# Altium schematic sheet 24Vto5V.SchDoc
size 420 x 297 mm; SheetNumber: 3; SheetTotal: 5
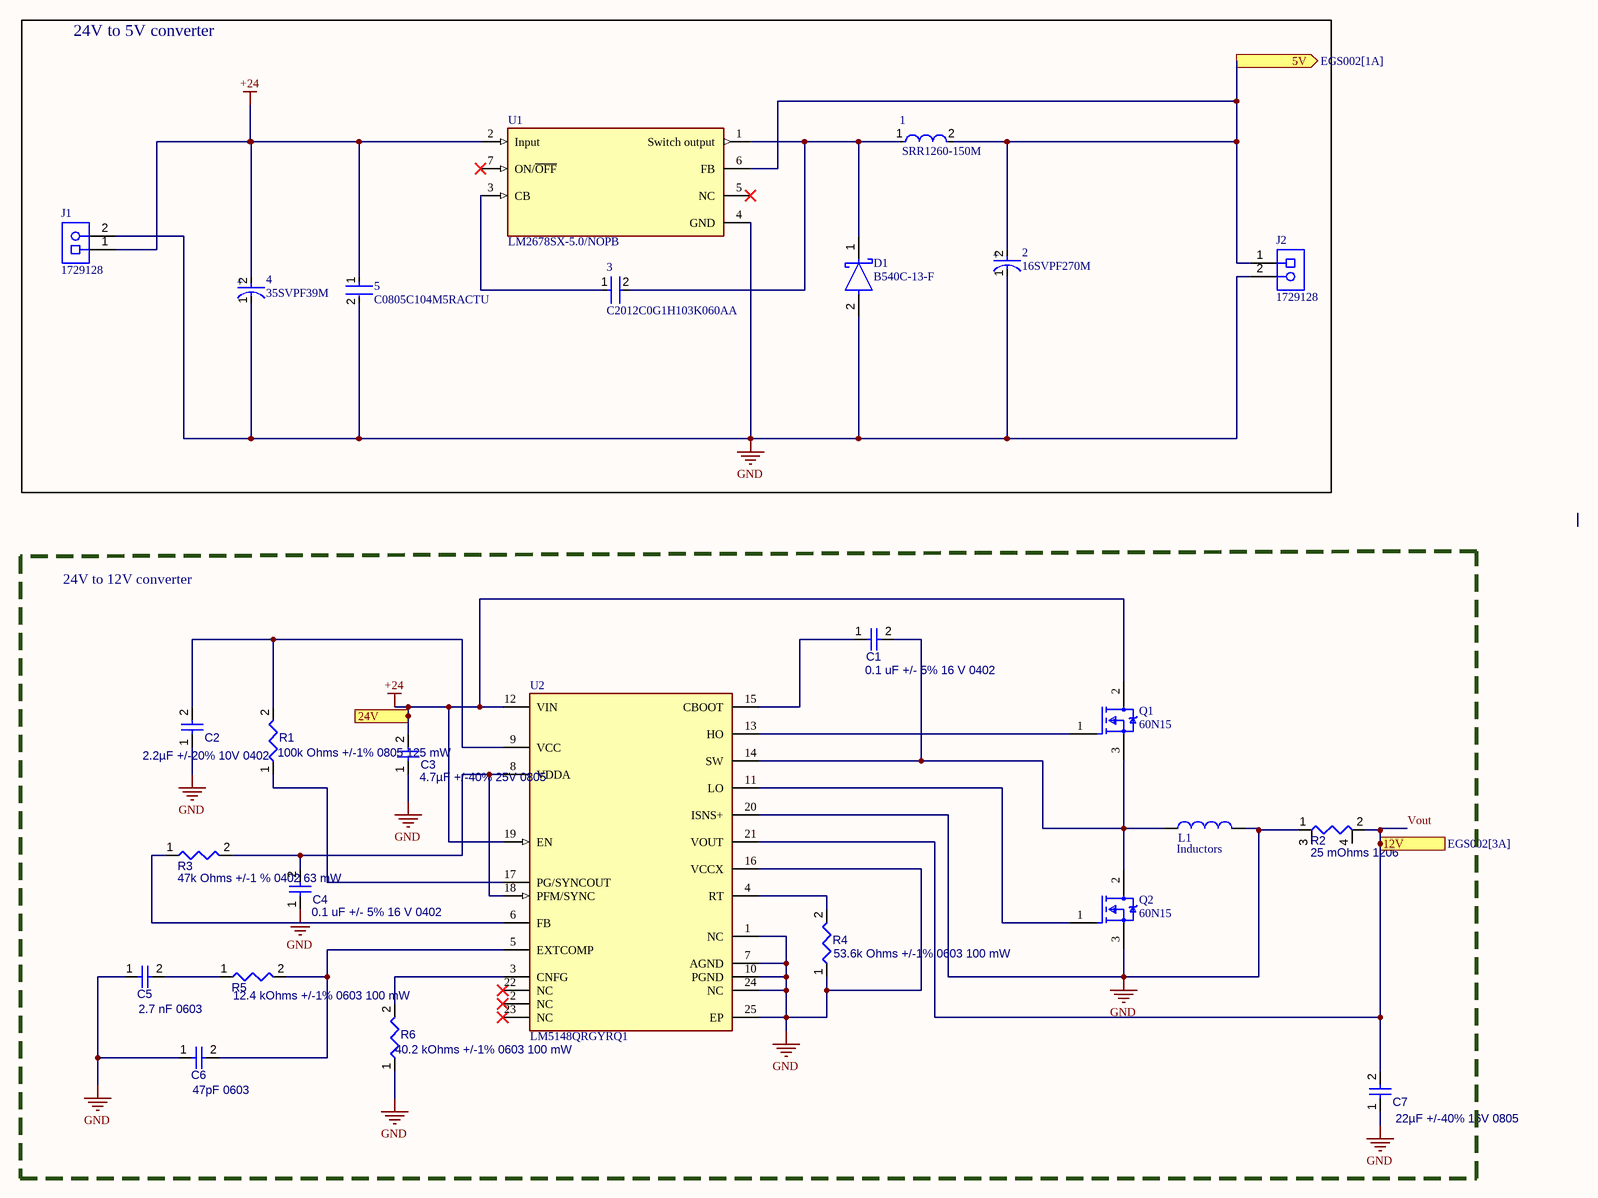
[diagram p0: 24Vto5V.SchDoc]

## Parts
1  SRR1260-150M  [FP-SRR1260-MFG]
2  16SVPF270M  [FP-OS-CON-SMT-E7-MFG]
3  C2012C0G1H103K060AA  [FP-C2012-060-0_2-IPC_A]
4  35SVPF39M  [FP-OS-CON-SMT-E7-MFG]
5  C0805C104M5RACTU  [FP-C0805C-DN-MFG]
C1  0.1 uF +/- 5% 16 V 0402  [CAPC1005X56X25LL10T15]
C2  2.2µF +/-20% 10V 0402  [CAPC0402(1005)60_L]
C3  4.7µF +/-40% 25V 0805  [CAPC0805(2012)145_L]
C4  0.1 uF +/- 5% 16 V 0402  [CAPC1005X56X25LL10T15]
C5  2.7 nF 0603  [CAPC1608X87X35NL15T15]
C6  47pF 0603  [CAPC0603(1608)100_L]
C7  22µF +/-40% 16V 0805  [CAPC0805(2012)145_L]
D1  B540C-13-F  [FP-SMC-MFG]
J1  1729128  [PHOE-1729128-2_V]
J2  1729128  [PHOE-1729128-2_V]
L1  Inductors
Q1  60N15  [FP-TO-220AB-MFG]
Q2  60N15  [FP-TO-220AB-MFG]
R1  100k Ohms +/-1% 0805 125 mW  [RESC2013X70X40ML20T20]
R2  25 mOhms 1206  [SUSUMU-3216T4A]
R3  47k Ohms +/-1 % 0402 63 mW  [RESC0402(1005)_L]
R4  53.6k Ohms +/-1% 0603 100 mW  [RESC1608X55X25ML10T15]
R5  12.4 kOhms +/-1% 0603 100 mW  [RESC1608X55X25ML10T15]
R6  40.2 kOhms +/-1% 0603 100 mW  [RESC1608X55X25ML10T15]
U1  LM2678SX-5.0/NOPB  [FP-KTW0007B-MFG]
U2  LM5148QRGYRQ1  [FP-RGY0024E-MFG]

## Blocks framed on the sheet
24V to 5V converter: 1-5 D1 J1 J2 U1
24V to 12V converter: C1-C7 L1 Q1 Q2 R1-R6 U2

## Ports
5V (out, see EGS002[1A]), 12V (out, see EGS002[3A]), 24V

## Nets
+24: 4.2(A) 5.1 C3.2 J1.1 Q1.2(DRAIN) U1.2(Input) U2.12(VIN) U2.19(EN) ; port 24V
GND: 2.1(C) 4.1(C) 5.2 C2.1 C3.1 C4.1 C5.1 C6.1 C7.1 D1.2(A) J1.2 J2.2 L1.2 Q2.3(SOURCE) R2.1(I1) R4.1 R6.1 U1.4(GND) U2.1(NC) U2.7(AGND) U2.10(PGND) U2.16(VCCX) U2.20(ISNS+) U2.24(NC) U2.25(EP)
5V: 1.2 2.2(A) J2.1 U1.6(FB) ; port 5V
Vout: C7.2 R2.2(I2) U2.21(VOUT) ; port 12V
Net1_1: 1.1 3.2 D1.1(C) U1.1(Switch_output)
Net3_1: 3.1 U1.3(CB)
NetC1_1: C1.1 U2.15(CBOOT)
NetC1_2: C1.2 L1.1 Q1.3(SOURCE) Q2.2(DRAIN) U2.14(SW)
NetC2_2: C2.2 R1.2 U2.9(VCC)
NetC4_2: C4.2 R3.2 U2.8(VDDA) U2.18(PFM/SYNC)
NetC5_2: C5.2 R5.1
NetC6_2: C6.2 R5.2 U2.5(EXTCOMP)
NetQ1_1: Q1.1(GATE) U2.13(HO)
NetQ2_1: Q2.1(GATE) U2.11(LO)
NetR1_1: R1.1 U2.17(PG/SYNCOUT)
NetR3_1: R3.1 U2.6(FB)
NetR4_2: R4.2 U2.4(RT)
NetR6_2: R6.2 U2.3(CNFG)

Not connected (* = marked no-connect by the designer): R2 3(E1) 4(E2); U1 5(NC)* 7(ON/~{OFF})*; U2 2(NC)* 22(NC)* 23(NC)*

## Notes on the sheet
- THIS DOCUMENT AND THE DATA DISCLOSED HEREIN OR
- HEREWITH IS THE PROPERTY OF ALTIUM LIMITED AND MAY
- DWG NO:
- REVISION
- REV:
- DESCRIPTION
- DATE
- APPROVED
- BE FREELY DISTRIBUTED IN WHOLE. NO RIGHTS ARE
- RESERVED OR EXPRESS OR IMPLIED WARANTEE GIVEN.
- ENG:
- APPROVALS
- PROJECT
- DSN:
- CHK:
- REFERENCE DOCUMENTS
- PROJECT REVISION:
- TITLE
- DOCUMENT REVISION:
- DESIGN ITEM:
- BOM:
- FAB DWG:
- PCB DWG:
- ASSY DWG:
- SCALE:
- A3
- SIZE
- CAGE CODE
- FILE NAME
- DWG NO.
- SHEET
- OF
- REV
- (in symbol CMP-05428-001376-1) +
- (in symbol CMP-05428-001379-1) +

## Library data of the parts
1 = CMP-2000-07146-2: FIXED IND 15UH 5A 27 MOHM SMD; Q Factor: 25; Sample Rate (Hz): 100kHz; Resistance: 27MR; Inductance Tolerance: 20%; Frequency: 17.6MHz; Saturation Current: 4.6A; Core Material: Ferrite; Shielding: Shielded; Series: SRR1260; Termination: SMD/SMT; Packaging: Tape and Reel; Material: Steel; RoHS Compliant: Yes; Height - Seated (Max): 0.256inch; Depth: 12.8mm; Case/Package: 1260; Inductance: 15uH; Height: 6mm; Number of Pins: 2; Mount: Surface Mount; Min Operating Temperature: -40°C; Test Frequency: 100kHz; Length: 12.5mm; Self Resonant Frequency: 17.6MHz; Current Rating: 5A; Tolerance: 20%; RMS Current (Irms): 5A; REACH SVHC: No SVHC; Resistor Type: Wirewound; DC Resistance (DCR): 27mR; Width: 12.5mm; Package Quantity: 600; DC Current: 5A; Max DC Current: 5A; Max Operating Temperature: 125°C; Military Standard: Not
2 = CMP-05428-001376-1: Conductive Polymer Aluminum Solid Capacitors (OS-CON) 270uF ±20% 16V RADIAL SMT 8x6.9mm; Polarity: Polar; ESR (Equivalent Series Resistance): 22mR; Leakage Current: 864uA; Life (Hours): 5000Hour; Ripple Current (AC): 3.3A; Dissipation Factor: 12%; Height: 6.9mm; Voltage: 16V; Termination: SMD/SMT; Lead Free: Lead Free; Max Operating Temperature: 105°C; Mount: Surface Mount; Radiation Hardening: No; Length: 6.9mm; Diameter: 8mm; REACH SVHC: No SVHC; Construction: Cylindrical; Case/Package: Radial; Voltage Rating: 16V; Min Operating Temperature: -55°C; Package Quantity: 1000; Number of Pins: 7; Capacitance: 270uF; Packaging: Tape and Reel; Height - Seated (Max): 0.276inch; Series: OS-CON™, SVPF; Ripple Current: 3.3A; Tolerance: 20%; Voltage Rating (DC): 16V; RoHS Compliant: Yes
3 = CMP-08246-006733-1: Multilayer Ceramic Capacitors 10nF ±10% 50V C0G SMD 0805; Case Code (Metric): 2012; Width: 0.049inch; Max Operating Temperature: 125°C; Series: C; Length: 0.079inch; Tolerance: 10%; Packaging: Tape and Reel; Height: 0.6mm; Voltage Rating (DC): 50V; Weight: 0.000194oz; Thickness: 0.03inch; Termination: SMD/SMT; Lead Free: Lead Free; Case/Package: 0805; Package Quantity: 1; Capacitance: 10nF; Mount: Surface Mount; Voltage Rating: 50V; Dielectric: C0G; Min Operating Temperature: -55°C; Case Code (Imperial): 0805; RoHS Compliant: Yes; Dielectric Material: Ceramic
4 = CMP-05428-001379-1: Conductive Polymer Aluminum Solid Capacitors (OS-CON) 39uF ±20% 35V RADIAL SMT 8x6.9mm; Ripple Current: 2.8A; Life (Hours): 5000Hour; Polarity: Polar; ESR (Equivalent Series Resistance): 30mR; Dissipation Factor: 12%; Leakage Current: 273uA; Height: 6.9mm; Tolerance: 20%; Series: OS-CON™, SVPF; Lead Free: Lead Free; Diameter: 8mm; Case/Package: Radial; Voltage: 35V; Package Quantity: 1000; Min Operating Temperature: -55°C; Packaging: Tape and Reel; Height - Seated (Max): 0.276inch; Voltage Rating (DC): 35V; Ripple Current (AC): 2.8A; Termination: SMD/SMT; Number of Pins: 7; Max Operating Temperature: 105°C; Voltage Rating: 35V; RoHS Compliant: Yes; REACH SVHC: No SVHC; Length: 6.9mm; Capacitance: 39uF; Mount: Surface Mount
5 = CMP-1036-04423-3: CAP CER 0.1UF 50V X7R 0805; Manufacturer: KEMET; Tolerance: 0.2; Temperature Coefficient: 30ppm/°C; Capacitance: 0.10 μF; Value: 0.10 μF; Temperature: -55°C to +125°C; RoHS: TRUE; Temperature Range Low: -55°C; Device Class L3: Ceramic Capacitors; Manufacturer Part Number: C0805C104M5RACTU; Octopart: https://octopart.com/c0805c104m5ractu-kemet-129379; Ipc Land Pattern Name: CAPC200125X78; Mouser Description: Multilayer Ceramic Capacitors MLCC - SMD/SMT 50volts 0.1uF X7R 20%; Temperature Range High: +125°C; Material: Ceramic; Package: C0805C-DN; Temperature Characteristic: X7R; Automotive: No; ComponentLink2URL: https://content.kemet.com/datasheets/KEM_C1003_C0G_SMD.pdf; Device Class L1: Passive Components; ComponentLink2Description: Datasheet; Device Class L2: Capacitors; Voltage Rating: 50 V; Digikey Description: CAP CER 0.1UF 50V X7R 0805; Lead Free: Yes; Height: 0.88mm; Category: Cap
C1 C4 = CMP-001-00001-6: Chip Capacitor, 0.1 uF, +/- 5%, 16 V, 0402 (1005 Metric); Capacitor Type: Ceramic; Voltage Rating: 16V; Value: 100nF; Mounting Technology: SM; Case/Package: 0402; Pins: 2; RoHS Compliant: True; Min Operating Temperature: -55°C; Max Operating Temperature: 125°C; Tolerance: 5%
C2 = CMP-001-00056-4: Chip Capacitor, 2,2µF +/-20%, 10V, 0402, Thickness 0.6 mm; Tolerance: 10%; Mounting Technology: SMT; Case/Package: 0402; Pins: 2; Min Operating Temperature: -55°C; Max Operating Temperature: 85°C; Voltage Rating: 10V; Value: 2.2µF
C3 = CMP-001-00080-4: Chip Capacitor, 4.7µF +/-40%, 25V, 0805, Thickness 1.45 mm; Tolerance: 20%; Mounting Technology: SMT; Case/Package: 0805; Pins: 2; Min Operating Temperature: -55°C; Max Operating Temperature: 85°C; Voltage Rating: 25V; Value: 4.7µF
C5 = CMP-001-00012-6: Chip Capacitor, 10 pF, +/- 0.25 pF, 50 V, 0603 (1608 Metric); Capacitor Type: Ceramic; Voltage Rating: 50V; Tolerance: 0.25%; Value: 10pF; Mounting Technology: SM; Case/Package: 0603; Pins: 2; RoHS Compliant: True; Min Operating Temperature: -55°C; Max Operating Temperature: 125°C
C6 = CMP-001-00077-3: Chip Capacitor, 470nF +/-20%, 25V, 0603, Thickness 1 mm; Tolerance: 10%; Mounting Technology: SMT; Case/Package: 0603; Pins: 2; Min Operating Temperature: -55°C; Max Operating Temperature: 85°C; Voltage Rating: 25V; Value: 470nF
C7 = CMP-001-00081-4: Chip Capacitor, 22µF +/-40%, 16V, 0805, Thickness 1.45 mm; Tolerance: 5%; Mounting Technology: SMT; Case/Package: 0805; Pins: 2; Min Operating Temperature: -55°C; Max Operating Temperature: 85°C; Voltage Rating: 16V; Value: 22µF
D1 = CMP-2000-05097-3: DIODE SCHOTTKY 40V 5A SMC; Manufacturer: Diodes Inc.; Automotive Grade: NA; Peak Reverse Current: 0.5mA; Value: 300pF; Max Junction Temp: +150°C; Max Surge Forward Current: 100A; Standoff Height: 0.1mm; Digikey Description: DIODE SCHOTTKY 40V 5A SMC; Temperature Range Low: -55°C; Manufacturer Part Number: B540C-13-F; Octopart: https://octopart.com/b540c-13-f-diodes+inc.-325873; Lead Free: Yes; Reverse Voltage: 40V; RoHS: TRUE; Category: Diode; Mouser Description: Diode: Schottky rectifying; SMD; 40V; 5A; SMC; Package: reel, tape; ComponentLink2Description: Datasheet; Temperature Range High: +150°C; Automotive: No; Footprint Url: https://www.diodes.com/assets/Package-Files/SMC.pdf; Device Class L3: Schottky Diodes; Height: 2.5mm; Forward Current: 5A; Temperature: -55°C to +150°C; Package: SMC; ComponentLink2URL: https://www.diodes.com/assets/Datasheets/ds13012.pdf; Device Class L2: Diodes; Max Repetitive Reverse Voltage: 40V; Device Class L1: Discrete Semiconductors; Capacitance: 300pF
J1 J2 = CMP-2000-05815-1: PCB Terminal Block, 13.5 A, 400 V, 2-Pin THD, RoHS, Bulk; Manufacturer: Phoenix Contact; Package Version: 03/2015; No. of Rows: 1; Pitch: 5.08mm; No. of Positions: 2; Voltage Rating: 400V; Current Rating: 13500mA; Manufacturer URL: http://www.phoenixcontact.com/; Datasheet URL: https://datasheet.ciiva.com/16046/1729128-16046181.pdf; RoHS: TRUE; Package URL: https://www.phoenixcontact.com/online/portal/pi/pxc/product_detail_page/!ut/p/b1/3VdJjqNKFDxLH8AFycySyWY2ozFsEPOMMQaDOX1XedGL_1Vdm5YXJleknhSKeBkvI6EA8ncAo3AYoDhBQGco6KN7VURTdemj9us_IEKEZo_YHiPAEWEFmDGOHMORkqKYCORBZxgL7ZoaZYcbFFUZ3fqxSY6GOuxydWUuHqz1ynmMFygu583Bob0Ewr6Sd_l-5m-kAueHiB0jpRwZwe58wwtkpxtMYd_LmGcDRU02dRNEyWt6Y2ti5pSyJ_reIkzIulrqApdnbT11V5jnCKbYNCvhEM1MCpPByat_X379-iThf08CI5GfOPqfBeS3BRoBOdD55AKVv0iLwCMq-2BrzXWSGRH7pUGD9uwXQjiph3xL0DKQwdGa0JImiIOmBNOestqgwTHSSs2oOep-78apyXQBvNi8ZLaFjvjWvcaUEBu0MC6Wbe-d6mB0FAebo2lUWinqYaZs5DAYzV0RP9yitUjnGJ0iI9xhZkT42OCQNUJJhkgWINNQLP2JFP6OpMg3JCVg70jqHT0lvKOnhHf0lPuOnnLf0VPuWx6_dxwUIvwk5WMkT0kLL1mh61l2yZVSzG3pYV_bqo-mj6uMKwKwdnnW8Jh5RTOJzMOA5c-eJDaZQw4mTMPH02PvS_ZAqNVjVTo2WyYLkwH_KU1mmmG5kjRhDqPXLwwVHvVOjCM60-fpXvTDfMGW1PVFVS1r4e4yVDk4ZdNbkUHvqPqQSeian4UD39fNKmachqdJ1NJbyk8rXT9mXTvPk3oE5meulKGgiruPJek-4I9hTT6G8ZLOyRSm2RRVbThERQad5OS28hdt4YW4vG0stgYYzsWsK4_7y6DZMjJSCqri1kyiZR5vD7pwIrNR7QwPHTcLTI5qT7eRlpHrdGiupYlqQDJ7zy_CND8fWWBoLRXxk1RVcXiBQwbTD4Xi7KL-FuO94t9xaqweXzH; PartNumber: 1729128; Package Description: 2-Pin Through Hole Device, Body 8.1 x 10.16 mm, Pitch 5.08 mm; Datasheet Version: 12/2013; Mounting Technology: ThroughHole; Orientation: Horizontal; Package Reference: 1729128-2; Packing: Bulk
L1 = Inductors: 24.65uH; Component Type: Inductors
Q1 Q2 = CMP-00196-65872431-1: 60N15 150V 60A N-Channel MOSFET TO-220; Number of Elements: 1; Input Capacitance: 2.29nF; Turn-Off Delay Time: 55ns; Drain to Source Breakdown Voltage: 60V; Power Dissipation: 110W; Turn-On Delay Time: 13ns; Max Junction Temperature (Tj): 175°C; Drain to Source Resistance: 7.1mΩ; Continuous Drain Current (ID): 79A; Rds On Max: 8.4mΩ; Gate to Source Voltage (Vgs): 20V; Element Configuration: Single; Length: 10.67mm; Radiation Hardening: No; NexarPartId: 65872431; Case/Package: TO-220AB; Width: 4.83mm; Min Operating Temperature: -55°C; Max Operating Temperature: 175°C; Number of Pins: 3; Drain to Source Voltage (Vdss): 60V; Number of Channels: 1; Height: 9.02mm; Max Power Dissipation: 110W; Mount: Through Hole; RoHS: Compliant
R1 = CMP-009-00024-5: Chip Resistor, 100 KOhm, +/- 1%, 0.125 W, -55 to 155 degC, 0805 (2012 Metric); Power: 125mW; Voltage Rating: 150V; Mounting Technology: SM; Case/Package: 0805; Pins: 2; RoHS Compliant: True; Min Operating Temperature: -55°C; Max Operating Temperature: 155°C; Tolerance: 1%; Value: 100k
R2 = CMP-009-00119-3: Chip Resistor, 0,007 Ohms, +/-1%, 63 mW, -55 to 155 degC, 1206; Tolerance: 1%; Value: 7m; Case/Package: 1206; Pins: 4; Min Operating Temperature: -55°C; Max Operating Temperature: 155°C
R3 = CMP-009-00137-3: Chip Resistor, 47,5 kOhms, +/-1 %, 63 mW, -55 to 155 degC, 0402; Tolerance: 1%; Power: 63mW; Value: 47.5k; Case/Package: 0402; Pins: 2; Min Operating Temperature: -55°C; Max Operating Temperature: 155°C
R4-R6 = CMP-009-00017-5: Chip Resistor, 10 KOhm, +/- 1%, 01 W, -55 to 155 degC, 0603 (1608 Metric); Power: 100mW; Voltage Rating: 50V; Value: 10k; Mounting Technology: SM; Case/Package: 0603; Pins: 2; RoHS Compliant: True; Min Operating Temperature: -55°C; Max Operating Temperature: 155°C; Tolerance: 1%
U1 = CMP-04918-000486-1: IC REG BUCK 5V 5A TO263-7; Operating Supply Voltage: 40V; Min Supply Voltage: 8V; Synchronous Rectifier: No; Number of Outputs: 1; Quiescent Current: 4.2mA; Switching Frequency: 260kHz; Output Type: Fixed; Efficiency: 84%; Mount: Surface Mount; Output Current: 5A; RoHS Compliant: Yes; Min Input Voltage: 8V; Min Operating Temperature: -40°C; Max Operating Temperature: 125°C; Max Input Voltage: 40V; Series: SIMPLE SWITCHER®; Max Output Current: 5A; Case/Package: TO-263; Package Quantity: 500; Radiation Hardening: No; Output Voltage: 5V; Packaging: Tape and Reel; Lead Free: Contains Lead
U2 = CMP-00370-134525155-1: LM5148QRGYRQ1 Automotive, 80-V synchronous buck DC/DC controller with ultra-low IQ 24-VQFN -40 to 125; Manufacturer Lifecycle Status: ACTIVE; Case/Package: VQFN; Number of Pins: 24; Length: 5.5mm; Width: 3.5mm; Thickness: 900µm; NexarPartId: 134525155; Lifecycle Status: Production; Height: 1mm